# EAGLE design M220pal (EAGLE 6.6.0)
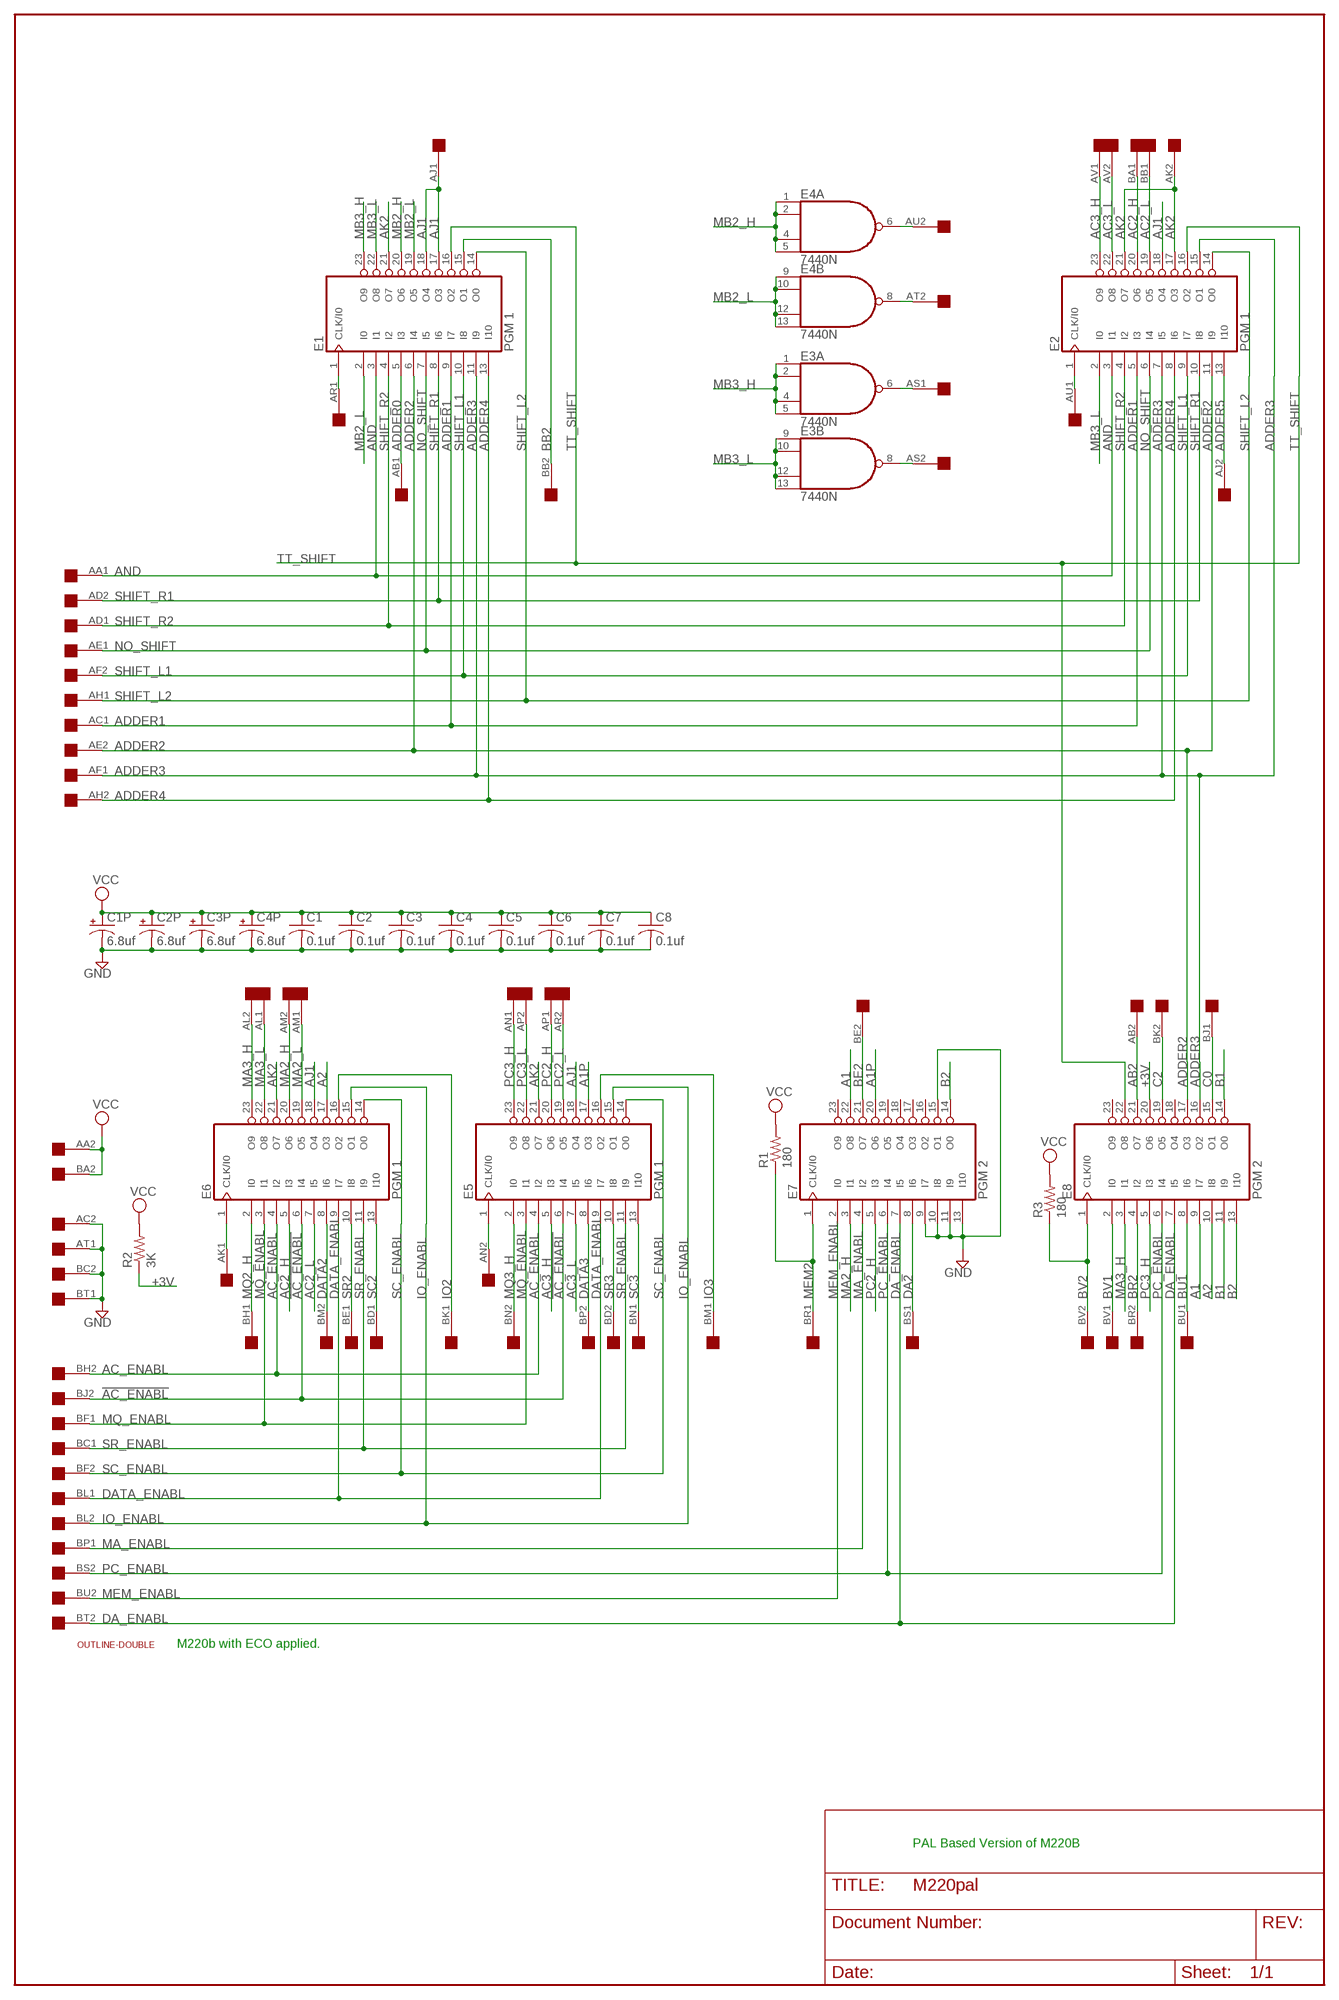
[diagram p0: schematic, sheet 1]

## Parts
C1  0.1uf  C-US050-025X075  [C050-025X075]
C1P  6.8uf  CPOL-USE15-5AXIAL  [E15-5]
C2  0.1uf  C-US050-025X075  [C050-025X075]
C2P  6.8uf  CPOL-USE15-5AXIAL  [E15-5]
C3  0.1uf  C-US050-025X075  [C050-025X075]
C3P  6.8uf  CPOL-USE15-5AXIAL  [E15-5]
C4  0.1uf  C-US050-025X075  [C050-025X075]
C4P  6.8uf  CPOL-USE15-5AXIAL  [E15-5]
C5  0.1uf  C-US050-025X075  [C050-025X075]
C6  0.1uf  C-US050-025X075  [C050-025X075]
C7  0.1uf  C-US050-025X075  [C050-025X075]
C8  0.1uf  C-US050-025X075  [C050-025X075]
E1  PGM 1  22V10  [DIL24-3]
E2  PGM 1  22V10  [DIL24-3]
E3  7440N  74S20N  [DIL14]
E4  7440N  74S20N  [DIL14]
E5  PGM 1  22V10  [DIL24-3]
E6  PGM 1  22V10  [DIL24-3]
E7  PGM 2  22V10  [DIL24-3]
E8  PGM 2  22V10  [DIL24-3]
R1  180  R-US_0207/10  [0207/10]
R2  3K  R-US_0207/10  [0207/10]
R3  180  R-US_0207/10  [0207/10]
U$1  DOUBLE  [EDGE-CON4]
U$2  OUTLINE-DOUBLE  [DOUBLE]

## Nets
!AC_ENABL: E5.6(I4) E6.6(I4) U$1.BJ2
+3V: E8.20(O6) R2.1
A1: E7.22(O8) E8.9(I7)
A1P: E5.17(O3) E7.20(O6)
A2: E6.17(O3) E8.10(I8)
AB2: E8.21(O7) U$1.AB2
AC2_H: E2.20(O6) E6.5(I3) U$1.BA1
AC2_L: E2.19(O5) E6.7(I5) U$1.BB1
AC3_H: E2.23(O9) E5.5(I3) U$1.AV1
AC3_L: E2.22(O8) E5.7(I5) U$1.AV2
AC_ENABL: E5.4(I2) E6.4(I2) U$1.BH2
ADDER0: E1.5(I3) U$1.AB1
ADDER1: E1.9(I7) E2.5(I3) U$1.AC1
ADDER2: E1.6(I4) E2.11(I9) E8.17(O3) U$1.AE2
ADDER3: E1.11(I9) E2.7(I5) E2.15(O1) E8.16(O2) U$1.AF1
ADDER4: E1.13(I10) E2.8(I6) U$1.AH2
ADDER5: E2.13(I10) U$1.AJ2
AJ1: E1.17(O3) E1.18(O4) E2.18(O4) E5.18(O4) E6.18(O4) U$1.AJ1
AK2: E1.21(O7) E2.17(O3) E2.21(O7) E5.21(O7) E6.21(O7) U$1.AK2
AND: E1.3(I1) E2.3(I1) U$1.AA1
AS1: E3.6(A:O) U$1.AS1
AS2: E3.8(B:O) U$1.AS2
AT2: E4.8(B:O) U$1.AT2
AU2: E4.6(A:O) U$1.AU2
B1: E8.11(I9) E8.14(O0)
B2: E7.14(O0) E8.13(I10)
BB2: E1.15(O1) U$1.BB2
BE2: E7.21(O7) U$1.BE2
BR2: E8.4(I2) U$1.BR2
BU1: E8.8(I6) U$1.BU1
BV1: E8.2(I0) U$1.BV1
BV2: E8.1(CLK/I0) R3.1 U$1.BV2
C0: E8.15(O1) U$1.BJ1
C2: E8.19(O5) U$1.BK2
DA2: E7.8(I6) U$1.BS1
DA_ENABL: E7.7(I5) E8.7(I5) U$1.BT2
DATA2: E6.8(I6) U$1.BM2
DATA3: E5.8(I6) U$1.BP2
DATA_ENABL: E5.9(I7) E6.9(I7) U$1.BL1
GND [Supply]: C1.2 C1P.- C2.2 C2P.- C3.2 C3P.- C4.2 C4P.- C5.2 C6.2 C7.2 C8.2 E7.9(I7) E7.10(I8) E7.11(I9) E7.13(I10) E7.15(O1) U$1.AC2 U$1.AT1 U$1.BC2 U$1.BT1
IO2: E6.16(O2) U$1.BK1
IO3: E5.16(O2) U$1.BM1
IO_ENABL: E5.15(O1) E6.15(O1) U$1.BL2
MA2_H: E6.20(O6) E7.3(I1) U$1.AM2
MA2_L: E6.19(O5) U$1.AM1
MA3_H: E6.23(O9) E8.3(I1) U$1.AL2
MA3_L: E6.22(O8) U$1.AL1
MA_ENABL: E7.4(I2) U$1.BP1
MB2_H: E1.20(O6) E4.1(A:I0) E4.2(A:I1) E4.4(A:I2) E4.5(A:I3)
MB2_L: E1.2(I0) E1.19(O5) E4.9(B:I0) E4.10(B:I1) E4.12(B:I2) E4.13(B:I3)
MB3_H: E1.23(O9) E3.1(A:I0) E3.2(A:I1) E3.4(A:I2) E3.5(A:I3)
MB3_L: E1.22(O8) E2.2(I0) E3.9(B:I0) E3.10(B:I1) E3.12(B:I2) E3.13(B:I3)
MEM2: E7.1(CLK/I0) R1.1 U$1.BR1
MEM_ENABL: E7.2(I0) U$1.BU2
MQ2_H: E6.2(I0) U$1.BH1
MQ3_H: E5.2(I0) U$1.BN2
MQ_ENABL: E5.3(I1) E6.3(I1) U$1.BF1
N$1: E6.1(CLK/I0) U$1.AK1
N$2: E5.1(CLK/I0) U$1.AN2
N$3: E1.1(CLK/I0) U$1.AR1
N$4: E2.1(CLK/I0) U$1.AU1
NO_SHIFT: E1.7(I5) E2.6(I4) U$1.AE1
PC2_H: E5.20(O6) E7.5(I3) U$1.AP1
PC2_L: E5.19(O5) U$1.AR2
PC3_H: E5.23(O9) E8.5(I3) U$1.AN1
PC3_L: E5.22(O8) U$1.AP2
PC_ENABL: E7.6(I4) E8.6(I4) U$1.BS2
SC2: E6.13(I10) U$1.BD1
SC3: E5.13(I10) U$1.BN1
SC_ENABL: E5.14(O0) E6.14(O0) U$1.BF2
SHIFT_L1: E1.10(I8) E2.9(I7) U$1.AF2
SHIFT_L2: E1.14(O0) E2.14(O0) U$1.AH1
SHIFT_R1: E1.8(I6) E2.10(I8) U$1.AD2
SHIFT_R2: E1.4(I2) E2.4(I2) U$1.AD1
SR2: E6.10(I8) U$1.BE1
SR3: E5.10(I8) U$1.BD2
SR_ENABL: E5.11(I9) E6.11(I9) U$1.BC1
TT_SHIFT: E1.16(O2) E2.16(O2) E8.22(O8)
VCC [Supply]: C1.1 C1P.+ C2.1 C2P.+ C3.1 C3P.+ C4.1 C4P.+ C5.1 C6.1 C7.1 C8.1 R1.2 R2.2 R3.2 U$1.AA2 U$1.BA2
Unconnected: E7.16(O2) E7.17(O3) E7.18(O4) E7.19(O5) E7.23(O9) E8.18(O4) E8.23(O9)

## Notes on the sheet
- M220b with ECO applied.
- PAL Based Version of M220B

## Power pins joined to a net without a drawn wire
GND: E1.12(GND) E2.12(GND) E3.7(P:GND) E4.7(P:GND) E5.12(GND) E6.12(GND) E7.12(GND) E8.12(GND)
VCC: E1.24(VCC) E2.24(VCC) E3.14(P:VCC) E4.14(P:VCC) E5.24(VCC) E6.24(VCC) E7.24(VCC) E8.24(VCC)

## Library data of the parts
C1-C8 = rcl:C-US: CAPACITOR, American symbol
C1P C2P C3P C4P = rcl:CPOL-US: POLARIZED CAPACITOR, American symbol
E1 E2 E5-E8 = pal:22V10: PAL; MPN: GAL22V10D-7LPN; OC_FARNELL: 1571925; OC_NEWARK: 97M0480
E3 E4 = 74xx-us:74*20: Dual 4-input NAND gate
R1-R3 = rcl:R-US_: RESISTOR, American symbol
U$1 = dec-con:DOUBLE: Double-Height DEC board
U$2 = dec-con:OUTLINE-*: Board outlines for DEC boards.

## Net classes
1 Supply: width 0.813 mm

## Board
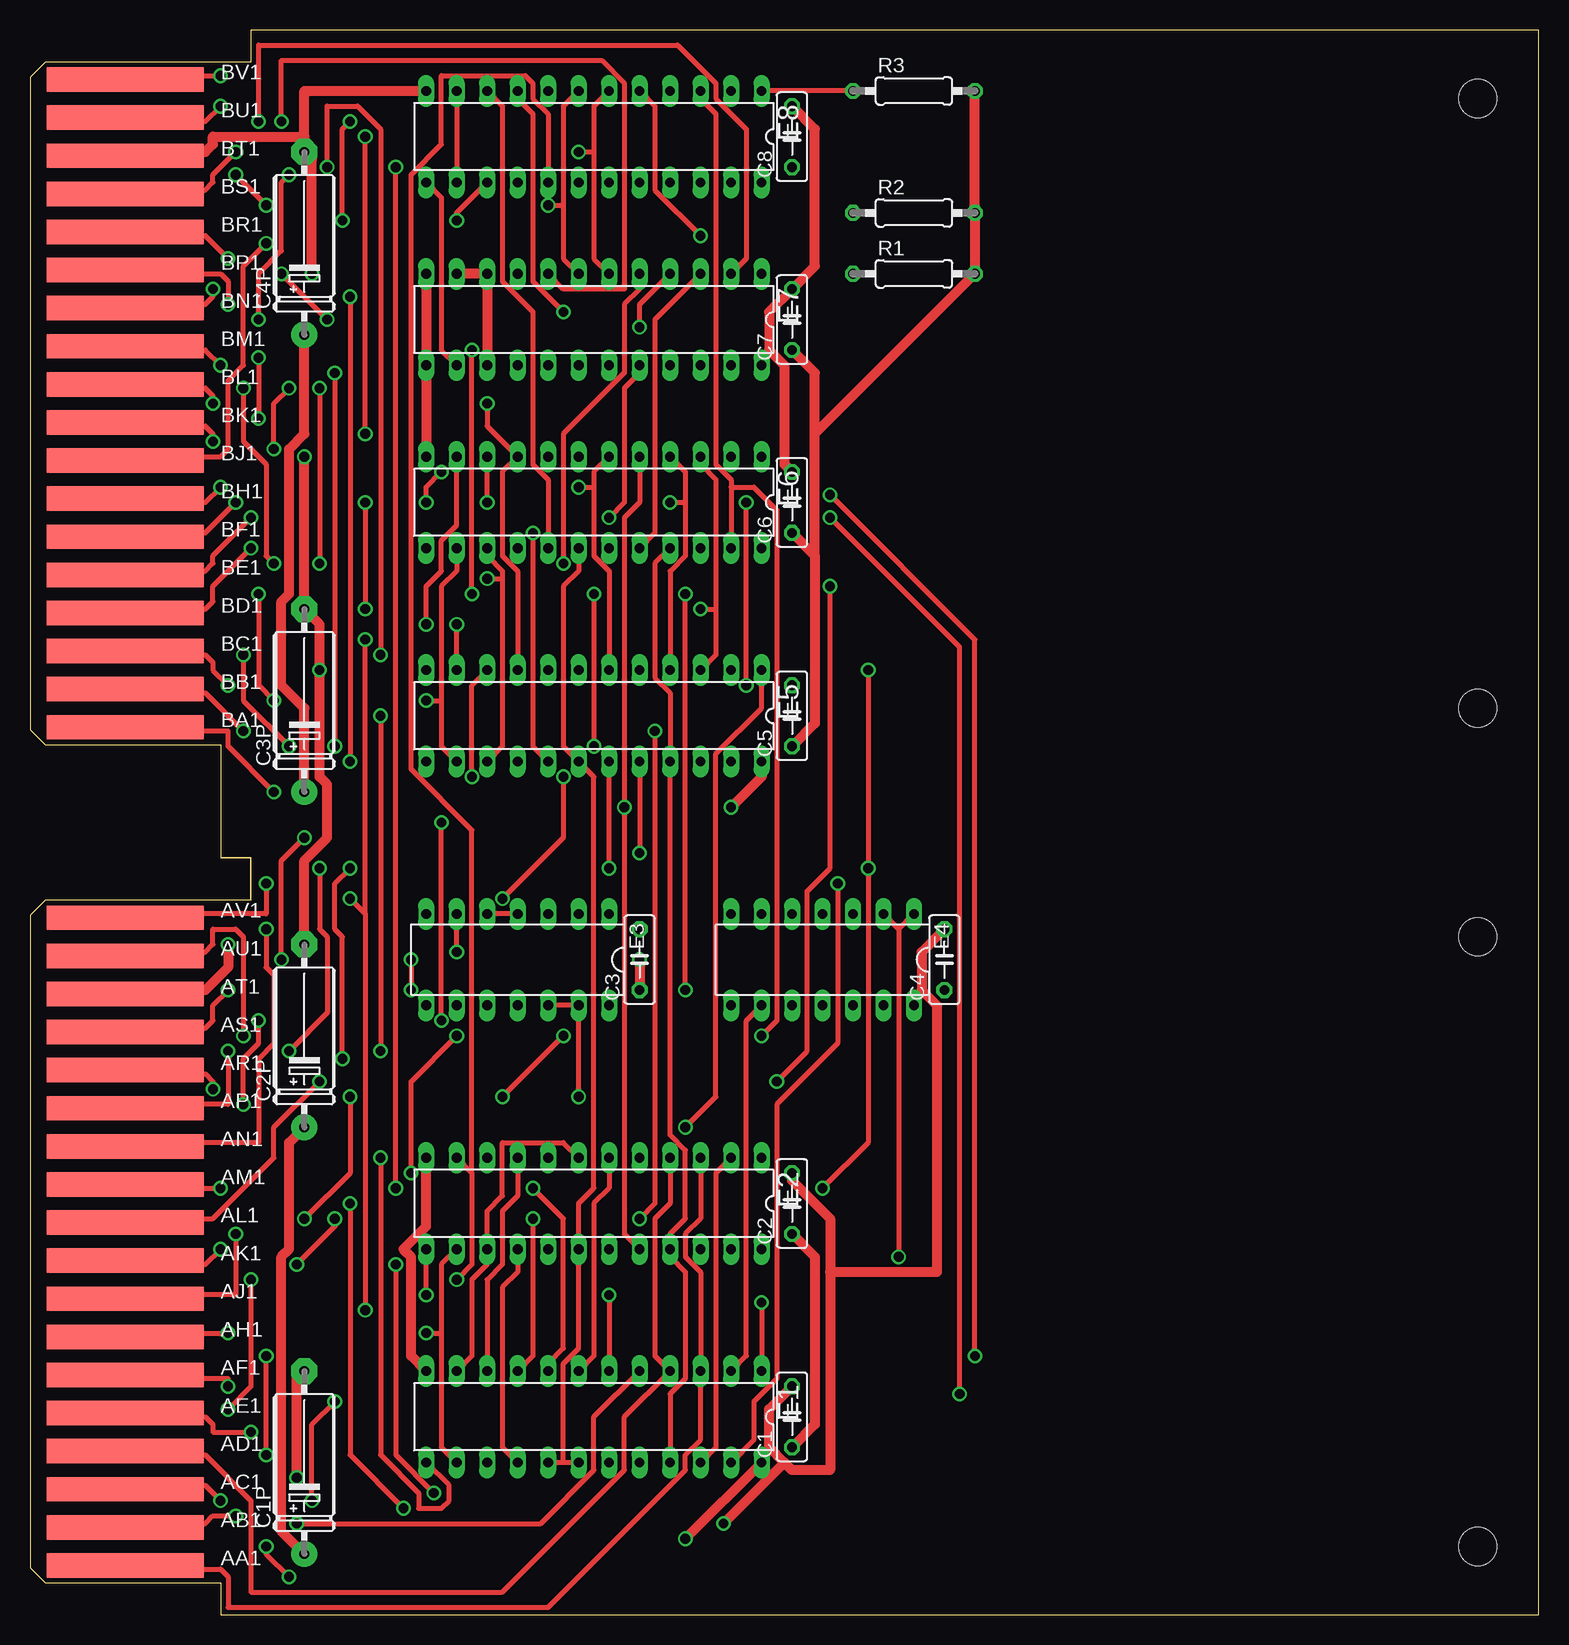
[diagram p1: board, top side]
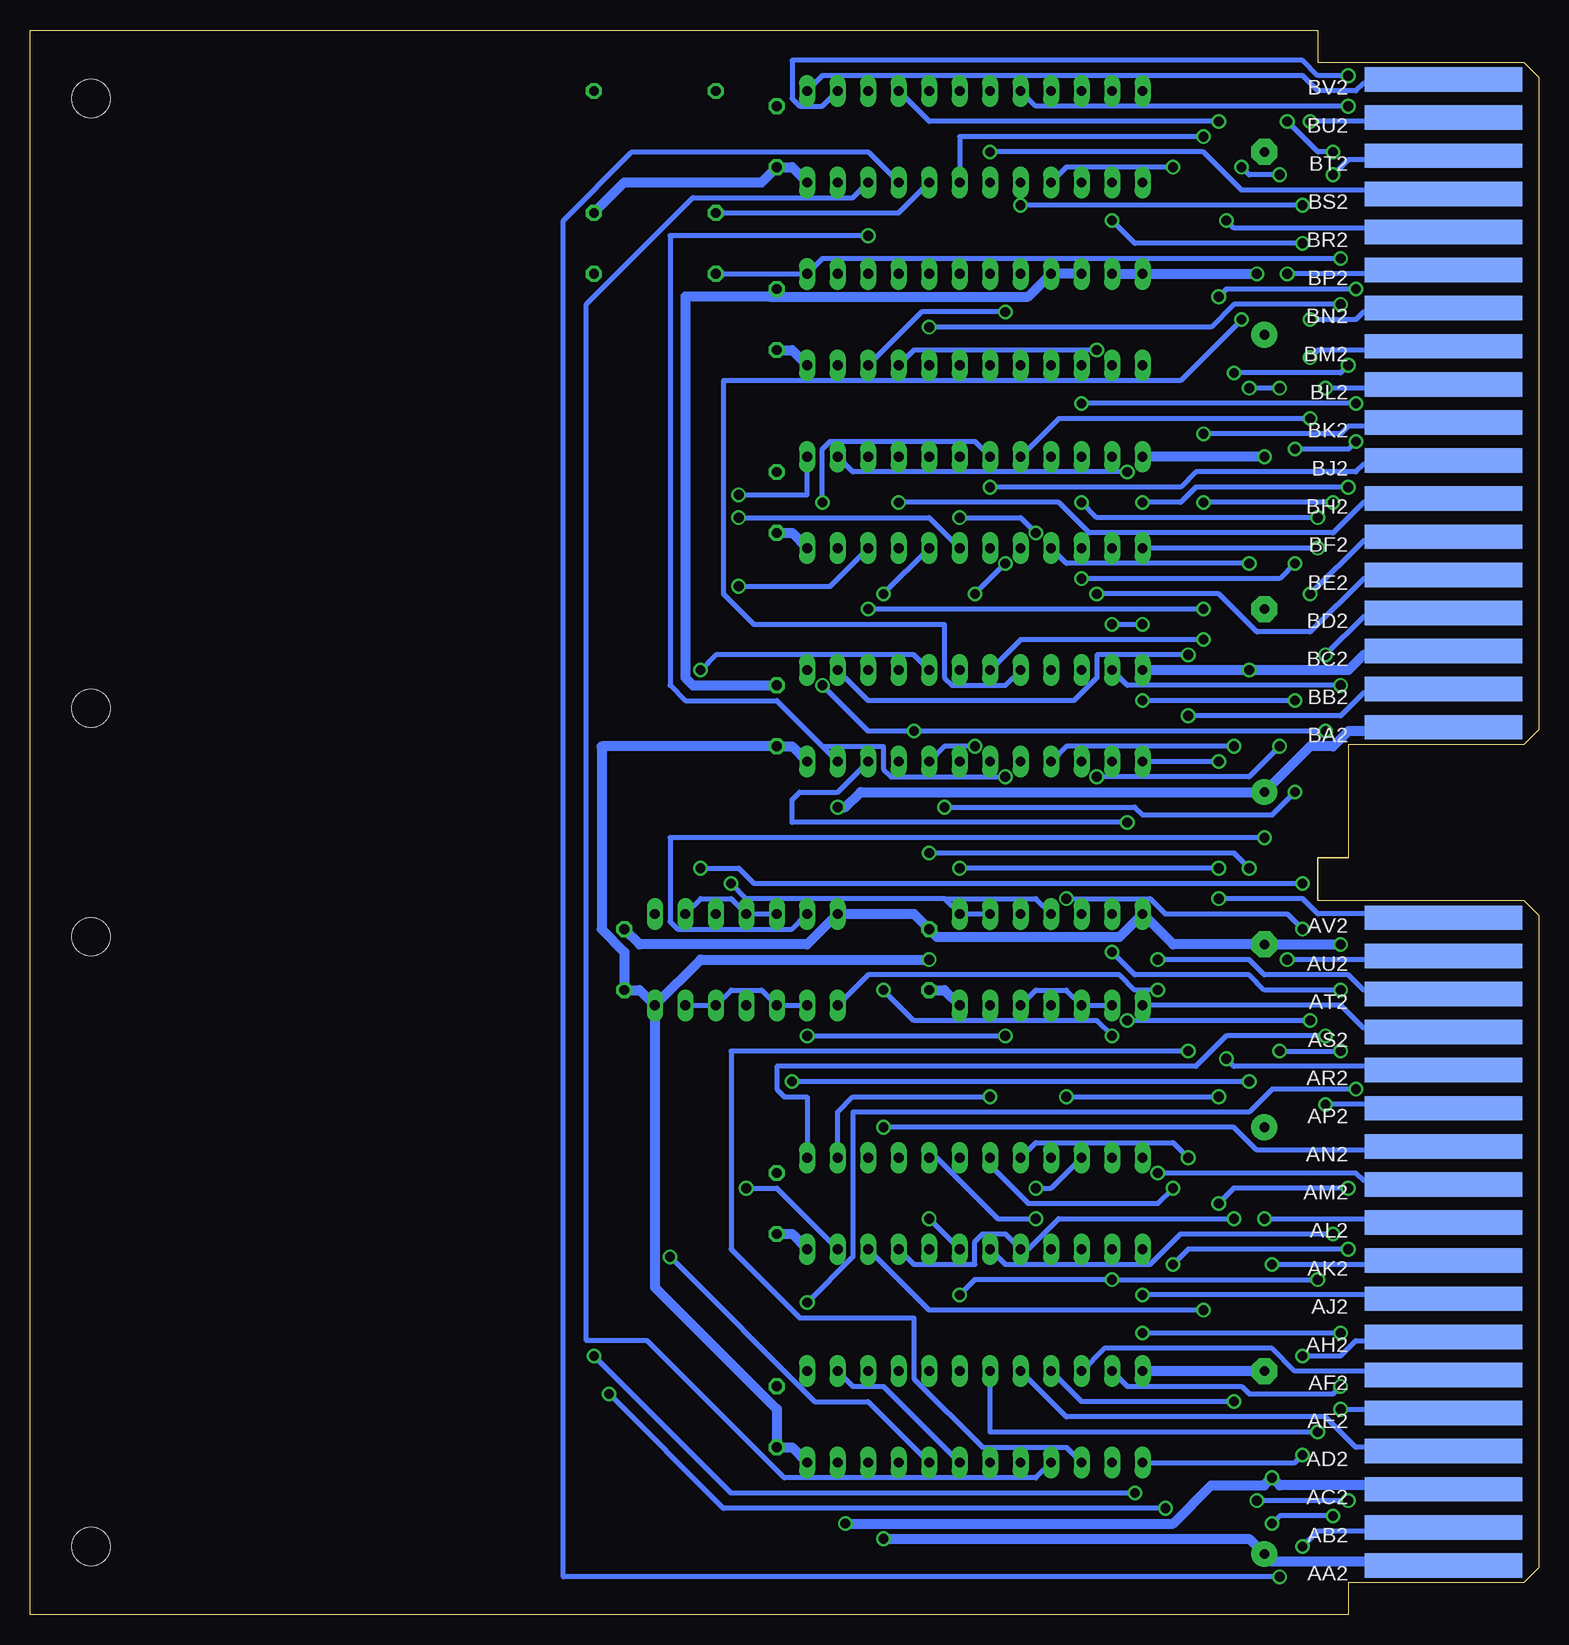
[diagram p2: board, bottom side, seen from below]

Size 125.73 x 132.08 mm. Coordinates in mm from the lower left corner, seen from the top.
Copper layers (1+16): Top 0.035mm / dielectric 1.5mm / Bottom 0.035mm
Design rules "16mils": minimum track width 16mil, minimum drill 32mil, track to track 15mil, track to pad 10mil, pad to pad 10mil, via to via 10mil, smd to smd 10mil, copper to edge 13mil, drill to drill 10mil, minimum pad ring 10mil, minimum via ring 8mil, stop-mask expansion 0mil, vias tented up to drill 0mil, thermal gap 10mil

### Footprints (pad centres in the part's own frame; a part is rotated, then mirrored left to right if it is on the bottom)
C050-025X075 = drill 0.813 octagon: 1 -2.54,0; 2 2.54,0
E15-5 = drill 0.813 pad 2.159: + -7.62,0 | drill 0.813 pad 2.159 octagon: - 7.62,0
DIL24-3 = drill 0.813 long: 1 -13.97,-3.81; 2 -11.43,-3.81; 3 -8.89,-3.81; 4 -6.35,-3.81; 5 -3.81,-3.81; 6 -1.27,-3.81; 7 1.27,-3.81; 8 3.81,-3.81; 9 6.35,-3.81; 10 8.89,-3.81; 11 11.43,-3.81; 12 13.97,-3.81; 13 13.97,3.81; 14 11.43,3.81; 15 8.89,3.81; 16 6.35,3.81; 17 3.81,3.81; 18 1.27,3.81; 19 -1.27,3.81; 20 -3.81,3.81; 21 -6.35,3.81; 22 -8.89,3.81; 23 -11.43,3.81; 24 -13.97,3.81
DIL14 = drill 0.813 long: 1 -7.62,-3.81; 2 -5.08,-3.81; 3 -2.54,-3.81; 4 0,-3.81; 5 2.54,-3.81; 6 5.08,-3.81; 7 7.62,-3.81; 8 7.62,3.81; 9 5.08,3.81; 10 2.54,3.81; 11 0,3.81; 12 -2.54,3.81; 13 -5.08,3.81; 14 -7.62,3.81
0207/10 = drill 0.813 octagon: 1 -5.08,0; 2 5.08,0
EDGE-CON4 = smd 13.106 x 2.032: AA1 7.938,4.128; AB1 7.938,7.303; AC1 7.938,10.477; AD1 7.938,13.652; AE1 7.938,16.828; AF1 7.938,20.003; AH1 7.938,23.177; AJ1 7.938,26.352; AK1 7.938,29.527; AL1 7.938,32.703; AM1 7.938,35.877; AN1 7.938,39.053; AP1 7.938,42.227; AR1 7.938,45.403; AS1 7.938,48.578; AT1 7.938,51.752; AU1 7.938,54.928; AV1 7.938,58.102; BA1 7.938,73.978; BB1 7.938,77.153; BC1 7.938,80.328; BD1 7.938,83.502; BE1 7.938,86.677; BF1 7.938,89.853; BH1 7.938,93.028; BJ1 7.938,96.203; BK1 7.938,99.377; BL1 7.938,102.552; BM1 7.938,105.728; BN1 7.938,108.903; BP1 7.938,112.078; BR1 7.938,115.252; BS1 7.938,118.427; BT1 7.938,121.603; BU1 7.938,124.778; BV1 7.938,127.953 | smd 13.106 x 2.032 bottom: AA2 7.938,4.128; AB2 7.938,7.303; AC2 7.938,10.477; AD2 7.938,13.652; AE2 7.938,16.828; AF2 7.938,20.003; AH2 7.938,23.177; AJ2 7.938,26.352; AK2 7.938,29.527; AL2 7.938,32.703; AM2 7.938,35.877; AN2 7.938,39.053; AP2 7.938,42.227; AR2 7.938,45.403; AS2 7.938,48.578; AT2 7.938,51.752; AU2 7.938,54.928; AV2 7.938,58.102; BA2 7.938,73.978; BB2 7.938,77.153; BC2 7.938,80.328; BD2 7.938,83.502; BE2 7.938,86.677; BF2 7.938,89.853; BH2 7.938,93.028; BJ2 7.938,96.203; BK2 7.938,99.377; BL2 7.938,102.552; BM2 7.938,105.728; BN2 7.938,108.903; BP2 7.938,112.078; BR2 7.938,115.252; BS2 7.938,118.427; BT2 7.938,121.603; BU2 7.938,124.778; BV2 7.938,127.953
DOUBLE = hole 3.175: 120.65,56.515; 120.65,5.715; 120.65,75.565; 120.65,126.365

### Placement (x,y rotation side)
C1  63.5,16.51 90 top
C1P  22.86,12.7 90 top
C2  63.5,34.29 90 top
C2P  22.86,48.26 90 top
C3  50.8,54.61 90 top
C3P  22.86,76.2 90 top
C4  76.2,54.61 90 top
C4P  22.86,114.3 90 top
C5  63.5,74.93 90 top
C6  63.5,92.71 90 top
C7  63.5,107.95 90 top
C8  63.5,123.19 90 top
E1  46.99,16.51 180 top
E2  46.99,34.29 180 top
E3  40.64,54.61 180 top
E4  66.04,54.61 180 top
E5  46.99,74.93 180 top
E6  46.99,92.71 180 top
E7  46.99,107.95 180 top
E8  46.99,123.19 180 top
R1  73.66,111.76 0 top
R2  73.66,116.84 0 top
R3  73.66,127 0 top
U$1  0,0 0 top
U$2  0,0 0 top

### Tracks (layer width: path | path; a pad name or v marks a point on that pad's centre or on a via)
!AC_ENABL  (via drill 0.81)
  Top 0.406: E5.6 48.26,87 46.99,88.27 46.99,93.98 | 46.99,93.98 46.99,95.25 E6.6 | v45.72,93.98 46.99,93.98
  Bottom 0.406: v45.72,93.98 29.85,93.98 28.58,95.25 15.24,95.25 14.61,95.89 8.26,95.89 U$1.BJ2
+3V
  Bottom 0.406: E8.20 53.34,116.84 R2.1
A1  (via drill 0.81)
  Top 0.406: v44.45,108.58 41.91,111.12 41.91,125.09 40.64,126.36 E8.9
  Bottom 0.406: E7.22 51.44,108.58 v44.45,108.58
A1P  (via drill 0.81)
  Top 0.406: E5.17 41.91,72.39 v41.91,90.17 | v48.26,91.44 49.53,92.71 49.53,102.23 50.8,103.5 E7.20
  Bottom 0.406: v41.91,90.17 43.18,91.44 v48.26,91.44
A2
  Top 0.406: E6.17 43.18,94.61 41.91,95.89 41.91,108.58 39.37,111.12 39.37,125.73 E8.10
AB2  (via drill 0.81)
  Top 0.406: v21.59,3.17 19.69,5.08 v19.69,5.71
  Bottom 0.406: E8.21 55.88,121.92 75.57,121.92 81.28,116.2 81.28,3.17 v21.59,3.17 | v19.69,5.71 18.42,6.99 8.26,6.99 U$1.AB2
AC2_H  (via drill 0.81)
  Top 0.406: E2.20 49.53,31.75 v49.53,67.31 49.53,91.44 50.8,92.71 E6.5 | v20.32,68.58 16.51,72.39 16.51,73.66 8.26,73.66 U$1.BA1
  Bottom 0.406: v20.32,68.58 22.23,66.67 33.02,66.67 33.66,67.31 v49.53,67.31
AC2_L  (via drill 0.81)
  Top 0.406: v59.69,77.47 v59.69,92.71 | v17.78,73.66 14.61,76.83 8.26,76.83 U$1.BB1 | v50.8,33.02 52.07,34.29 v52.07,73.66
  Bottom 0.406: E6.7 46.99,97.79 59.06,97.79 59.69,97.16 v59.69,92.71 | v59.69,77.47 55.88,73.66 v52.07,73.66 v17.78,73.66 | v50.8,33.02 E2.19
AC3_H  (via drill 0.81)
  Top 0.406: v66.04,35.56 69.85,39.37 v69.85,62.23 v69.85,78.74 | v19.69,60.96 19.69,58.42 8.26,58.42 U$1.AV1
  Bottom 0.406: E2.23 63.5,35.56 v66.04,35.56 | v69.85,78.74 68.58,80.01 52.07,80.01 E5.5 | v19.69,60.96 65.41,60.96 66.68,62.23 v69.85,62.23
AC3_L  (via drill 0.81)
  Top 0.406: 27.94,58.42 v27.94,25.4 | v26.67,59.69 27.94,58.42 | 27.94,58.42 v27.94,81.28
  Bottom 0.406: E2.22 50.8,25.4 v27.94,25.4 | v26.67,59.69 19.69,59.69 18.42,58.42 8.26,58.42 U$1.AV2 | E5.7 43.18,81.28 v27.94,81.28
AC_ENABL  (via drill 0.81)
  Top 0.406: E5.4 53.34,87 54.61,88.27 54.61,92.71 | 54.61,92.71 54.61,95.25 E6.4 | v53.34,92.71 54.61,92.71
  Bottom 0.406: v53.34,92.71 40.01,92.71 37.47,90.17 17.15,90.17 14.61,92.71 8.26,92.71 U$1.BH2
ADDER0  (via drill 0.81)
  Top 0.406: E1.5 46.99,16.51 46.99,12.06 42.55,7.62 v22.23,7.62 | v17.15,8.26 15.24,8.26 14.61,7.62 8.26,7.62 U$1.AB1
  Bottom 0.406: v22.23,7.62 21.59,8.26 v17.15,8.26
ADDER1  (via drill 0.81)
  Top 0.406: E1.9 41.91,21.59 v41.91,33.02 | v25.4,17.78 23.5,15.88 v23.5,9.53 | v15.88,9.53 14.61,10.79 8.26,10.79 U$1.AC1
  Bottom 0.406: v41.91,33.02 45.09,33.02 50.17,38.1 E2.5 | E1.9 38.1,17.78 v25.4,17.78 | v15.88,9.53 v23.5,9.53
ADDER2  (via drill 0.81)
  Top 0.406: v48.26,26.67 E1.6 | v35.56,27.94 36.83,29.21 36.83,36.83 | E2.11 36.83,36.83 | E8.17 43.18,125.09 41.91,126.36 41.91,127.64 41.28,128.27 34.29,128.27 34.29,122.56 31.75,120.02 31.75,70.48 36.83,65.41 36.83,36.83 | v16.51,17.14 18.42,19.05 v18.42,27.94
  Bottom 0.406: v48.26,26.67 46.99,27.94 v35.56,27.94 v18.42,27.94 | v16.51,17.14 8.26,17.14 U$1.AE2
ADDER3  (via drill 0.81)
  Top 0.406: E1.11 36.83,21.59 36.83,27.94 38.1,29.21 E2.15 38.1,33.66 39.37,34.92 39.37,39.37 44.45,39.37 E2.7 | v30.48,35.56 v30.48,120.65 | v16.51,19.05 16.51,19.68 8.26,19.68 U$1.AF1
  Bottom 0.406: E8.16 39.37,120.65 v30.48,120.65 | v30.48,35.56 31.75,34.29 42.55,34.29 45.72,37.47 E2.7 | v16.51,19.05 17.15,18.41 24.13,18.41 24.77,19.05 34.29,19.05 E1.11
ADDER4  (via drill 0.81)
  Top 0.406: E1.13 34.93,10.79 34.93,9.53 34.29,8.89 32.39,8.89 32.39,10.16 29.21,13.34 v29.21,38.1 | v19.69,13.34 v19.69,21.59
  Bottom 0.406: v29.21,38.1 30.48,39.37 41.91,39.37 E2.8 | v19.69,21.59 16.51,21.59 15.24,22.86 8.26,22.86 U$1.AH2 | v19.69,13.34 20.32,12.7 E1.13
ADDER5  (via drill 0.81)
  Top 0.406: v33.02,26.67 E2.13
  Bottom 0.406: v33.02,26.67 8.26,26.67 U$1.AJ2
AJ1  (via drill 0.81)
  Top 0.406: E6.18 45.72,87 44.45,85.72 44.45,72.39 E5.18 46.99,69.85 46.99,35.56 45.72,34.29 E2.18 45.72,22.23 44.45,20.95 44.45,12.7 | E1.18 44.45,12.7 | 44.45,12.7 E1.17 | v17.15,31.75 17.15,26.67 8.26,26.67 U$1.AJ1
  Bottom 0.406: v17.15,31.75 29.85,31.75 32.39,29.21 44.45,29.21 E2.18
AK2  (via drill 0.81)
  Top 0.406: E6.21 52.07,87.63 52.07,78.11 53.34,76.83 E5.21 53.34,40.01 54.61,38.73 54.61,33.02 53.34,31.75 E2.21 53.34,29.84 54.61,28.57 54.61,19.68 53.34,18.41 E1.21 | v22.23,29.21 25.4,32.38 v25.4,33.02
  Bottom 0.406: E2.21 52.07,29.21 46.99,29.21 46.99,31.11 46.36,31.75 44.45,31.75 E2.17 42.55,30.48 40.01,33.02 v25.4,33.02 | v22.23,29.21 8.26,29.21 U$1.AK2
AND
  Top 0.406: E2.3 55.88,33.02 54.61,31.75 54.61,29.84 55.88,28.57 E1.3 55.88,14.61 54.61,13.34 54.61,12.06 43.18,0.64 16.51,0.64 16.51,3.17 15.88,3.81 8.26,3.81 U$1.AA1
AS1  (via drill 0.81)
  Top 0.406: v35.56,55.24 E3.6 | v16.51,52.07 15.24,50.8 15.24,49.53 14.61,48.9 8.26,48.9 U$1.AS1
  Bottom 0.406: v35.56,55.24 33.66,53.34 24.13,53.34 22.86,52.07 v16.51,52.07
AS2
  Bottom 0.406: E3.8 16.51,50.8 14.61,48.9 8.26,48.9 U$1.AS2
AT2  (via drill 0.81)
  Top 0.406: v31.75,54.61 v31.75,52.07
  Bottom 0.406: E4.8 55.88,53.34 34.93,53.34 33.66,52.07 v31.75,52.07 | v31.75,54.61 24.13,54.61 22.86,53.34 15.88,53.34 14.61,52.07 8.26,52.07 U$1.AT2
AU2  (via drill 0.81)
  Top 0.406: v22.86,64.77 20.96,62.87 v20.96,54.61
  Bottom 0.406: E4.6 62.23,57.15 71.76,57.15 72.39,57.78 72.39,64.77 v22.86,64.77 | v20.96,54.61 8.26,54.61 U$1.AU2
B1
  Top 0.406: E8.11 E8.14
B2
  Top 0.406: E7.14 34.29,105.41 34.29,118.11 E8.13
BB2  (via drill 0.81)
  Top 0.406: v29.21,74.93 v29.21,46.99
  Bottom 0.406: E1.15 39.37,13.97 46.36,13.97 52.07,19.68 52.07,24.77 61.6,24.77 67.31,30.48 67.31,46.99 v29.21,46.99 | v29.21,74.93 16.51,74.93 14.61,76.83 8.26,76.83 U$1.BB2
BE2  (via drill 0.81)
  Top 0.406: v36.83,85.09 v36.83,105.41
  Bottom 0.406: E7.21 52.07,105.41 v36.83,105.41 | v36.83,85.09 26.67,85.09 23.5,81.92 19.05,81.92 14.61,86.36 8.26,86.36 U$1.BE2
BR2  (via drill 0.81)
  Top 0.406: v26.67,124.46 26.04,123.83 v26.04,116.2
  Bottom 0.406: E8.4 50.8,124.46 v26.67,124.46 | v26.04,116.2 25.4,115.57 8.26,115.57 U$1.BR2
BU1  (via drill 0.81)
  Top 0.406: v15.88,125.73 14.61,124.46 8.26,124.46 U$1.BU1
  Bottom 0.406: E8.8 41.91,125.73 v15.88,125.73
BV1  (via drill 0.81)
  Top 0.406: v15.88,128.27 8.26,128.27 U$1.BV1
  Bottom 0.406: E8.2 59.69,125.73 61.6,125.73 62.23,126.36 62.23,129.54 19.69,129.54 18.42,128.27 v15.88,128.27
BV2
  Top 0.406: R3.1 E8.1
  Bottom 0.406: E8.1 59.69,128.27 19.69,128.27 18.42,127 15.24,127 14.61,127.64 8.26,127.64 U$1.BV2
C0  (via drill 0.81)
  Top 0.406: E8.15 35.56,116.84 v35.56,116.2 | v19.69,114.3 17.78,112.39 17.78,104.14 16.51,102.87 16.51,97.16 15.88,96.52 8.26,96.52 U$1.BJ1
  Bottom 0.406: v35.56,116.2 33.66,114.3 v19.69,114.3
C2  (via drill 0.81)
  Top 0.406: v27.94,98.42 v27.94,123.19
  Bottom 0.406: E8.19 48.26,123.19 v27.94,123.19 | v27.94,98.42 16.51,98.42 15.88,99.06 8.26,99.06 U$1.BK2
DA2  (via drill 0.81)
  Top 0.406: E7.8 44.45,110.49 49.53,110.49 49.53,127.64 47.63,129.54 20.96,129.54 v20.96,124.46 | v17.15,121.92 15.24,120.02 15.24,119.38 14.61,118.75 8.26,118.75 U$1.BS1
  Bottom 0.406: v20.96,124.46 18.42,121.92 v17.15,121.92
DA_ENABL  (via drill 0.81)
  Top 0.406: E7.7 44.45,113.03 44.45,117.47 | 44.45,117.47 44.45,125.73 E8.7 | v43.18,117.47 44.45,117.47 | v17.15,120.02 v19.69,117.47
  Bottom 0.406: v19.69,117.47 v43.18,117.47 | v17.15,120.02 15.88,121.28 8.26,121.28 U$1.BT2
DATA2  (via drill 0.81)
  Top 0.406: v19.05,104.78 v19.05,99.69
  Bottom 0.406: E6.8 40.01,99.69 v19.05,99.69 | v19.05,104.78 18.42,105.41 8.26,105.41 U$1.BM2
DATA3  (via drill 0.81)
  Top 0.406: v20.96,111.76 v24.77,107.95
  Bottom 0.406: E5.8 44.45,77.47 48.9,77.47 49.53,78.11 49.53,82.55 65.41,82.55 67.95,85.09 67.95,102.87 29.85,102.87 v24.77,107.95 | v20.96,111.76 8.26,111.76 U$1.BP2
DATA_ENABL  (via drill 0.81)
  Top 0.406: E5.9 40.64,87 39.37,88.27 39.37,95.25 E6.9 38.1,99.06 v38.1,100.97 | v15.24,100.97 15.24,101.6 14.61,102.23 8.26,102.23 U$1.BL1
  Bottom 0.406: v15.24,100.97 v38.1,100.97
GND  (via drill 0.81)
  Top 0.813: E8.12 22.86,127 22.86,123.19 | 22.86,123.19 C4P.- 23.5,121.28 v23.5,111.76 | 22.86,123.19 15.24,123.19 15.24,122.56 14.61,121.92 8.26,121.92 U$1.BT1 | E6.12 E7.13 E7.12 | E7.15 E7.10 E7.11 | C6.2 62.87,95.89 62.87,104.14 61.6,105.41 61.6,108.58 C7.2 65.41,112.39 65.41,123.83 C8.2 | C2P.- 22.86,62.87 24.77,64.77 24.77,69.22 24.13,69.85 v24.13,78.74 24.13,82.55 C3P.- v22.86,96.52 | v16.51,55.88 16.51,53.98 14.61,52.07 8.26,52.07 U$1.AT1 | E2.12 33.02,32.38 31.12,30.48 31.75,29.84 31.75,21.59 E1.12 | C1P.- 22.23,19.68 v22.23,11.43 | C1.2 61.6,17.14 61.6,13.97 62.87,12.7 | 62.87,12.7 63.5,12.06 66.68,12.06 66.68,28.57 | 66.68,28.57 66.68,33.02 63.5,36.2 C2.2 | 66.68,28.57 75.57,28.57 75.57,50.8 74.3,52.07 74.3,55.24 C4.2 | 62.87,12.7 v57.79,7.62
  Bottom 0.813: E7.11 E7.12 v23.5,111.76 | E7.10 E7.9 42.55,109.86 64.14,109.86 | C5.2 70.49,77.47 71.12,78.11 71.12,109.86 64.14,109.86 | C7.2 64.14,109.86 | E5.12 v24.13,78.74 15.88,78.74 14.61,80.01 8.26,80.01 U$1.BC2 | v16.51,55.88 C2P.- 30.48,55.88 E3.7 34.93,56.52 50.17,56.52 C3.2 52.07,58.42 E4.7 60.96,55.88 74.93,55.88 C4.2 | C1P.- E1.12 | U$1.AC2 8.26,10.79 21.59,10.79 v22.23,11.43 22.86,10.79 27.31,10.79 30.48,7.62 v57.79,7.62 | v22.86,96.52 E6.12
IO2  (via drill 0.81)
  Top 0.406: v24.13,102.23 v24.13,87.63 | v21.59,102.23 20.32,100.97 v20.32,97.16 | v15.24,97.79 15.24,98.42 14.61,99.06 8.26,99.06 U$1.BK1
  Bottom 0.406: E6.16 39.37,87.63 v24.13,87.63 | v21.59,102.23 v24.13,102.23 | v20.32,97.16 15.88,97.16 v15.24,97.79
IO3  (via drill 0.81)
  Top 0.406: v25.4,103.5 v25.4,72.39 | v15.88,104.14 14.61,105.41 8.26,105.41 U$1.BM1
  Bottom 0.406: E5.16 39.37,72.39 v25.4,72.39 | v25.4,103.5 16.51,103.5 v15.88,104.14
IO_ENABL  (via drill 0.81)
  Top 0.406: E5.15 39.37,72.39 39.37,86.36 | 39.37,86.36 39.37,87 38.1,88.27 E6.15 | v38.1,86.36 39.37,86.36 | v20.32,87.63 19.69,88.27 19.69,95.89 17.78,97.79 v17.78,102.23
  Bottom 0.406: v38.1,86.36 21.59,86.36 v20.32,87.63 | v17.78,102.23 8.26,102.23 U$1.BL2
MA2_H  (via drill 0.81)
  Top 0.406: E6.20 52.07,90.17 52.07,107.95 E7.3 | v54.61,52.07 v54.61,85.09 | v35.56,48.26 31.75,44.45 v31.75,36.83
  Bottom 0.406: v54.61,85.09 E6.20 | v54.61,52.07 52.07,49.53 36.83,49.53 v35.56,48.26 | v31.75,36.83 15.24,36.83 14.61,36.2 8.26,36.2 U$1.AM2
MA2_L  (via drill 0.81)
  Top 0.406: v66.68,91.44 77.47,80.64 v77.47,18.41 | v31.12,8.89 26.67,13.34 v26.67,34.29 | v15.88,35.56 8.26,35.56 U$1.AM1
  Bottom 0.406: E6.19 50.8,91.44 v66.68,91.44 | v77.47,18.41 67.95,8.89 v31.12,8.89 | v26.67,34.29 25.4,35.56 v15.88,35.56
MA3_H  (via drill 0.81)
  Top 0.406: 58.42,93.98 58.42,94.61 57.15,95.89 57.15,125.09 55.88,126.36 E8.3 | 58.42,93.98 E6.23 | v22.86,33.02 26.67,36.83 v26.67,43.18 | v44.45,48.26 v39.37,43.18 | v60.96,48.26 62.23,49.53 62.23,92.08 60.33,93.98 58.42,93.98
  Bottom 0.406: v22.86,33.02 8.26,33.02 U$1.AL2 | v39.37,43.18 v26.67,43.18 | v60.96,48.26 v44.45,48.26
MA3_L  (via drill 0.81)
  Top 0.406: v66.68,85.72 66.68,62.23 64.77,60.33 64.77,46.99 v62.23,44.45 | v24.13,44.45 20.32,40.64 20.32,38.1 15.24,33.02 8.26,33.02 U$1.AL1
  Bottom 0.406: E6.22 59.06,85.72 v66.68,85.72 | v24.13,44.45 v62.23,44.45
MA_ENABL  (via drill 0.81)
  Top 0.406: E7.4 50.8,109.22 v50.8,107.31 | v16.51,109.22 16.51,111.12 15.88,111.76 8.26,111.76 U$1.BP1
  Bottom 0.406: v50.8,107.31 27.31,107.31 25.4,109.22 v16.51,109.22
MB2_H  (via drill 0.81)
  Top 0.406: 72.39,57.15 v72.39,29.84 | E4.2 72.39,57.15 | 72.39,57.15 E4.1
  Bottom 0.406: E4.5 E4.4 67.31,59.69 69.85,59.69 E4.2 | E1.20 55.88,17.78 60.33,17.78 v72.39,29.84
MB2_L
  Top 0.406: E4.9 59.69,49.53 59.69,21.59 E1.2
  Bottom 0.406: E4.9 E4.10 64.77,52.07 67.31,52.07 E4.12 E4.13 | E1.19 54.61,19.05 57.15,19.05 E1.2
MB3_H  (via drill 0.81)
  Top 0.406: E3.4 E3.5 | E1.23 60.33,14.61 60.33,17.78 62.23,19.68 62.23,42.55 67.31,47.62 v67.31,60.96
  Bottom 0.406: E3.2 E3.1 49.53,59.69 | v67.31,60.96 66.04,59.69 49.53,59.69 | E3.4 41.91,59.69 49.53,59.69
MB3_L  (via drill 0.81)
  Top 0.406: E3.12 E3.13 v45.72,43.18 | E1.22 57.15,13.97 57.15,36.83 E2.2
  Bottom 0.406: E3.9 E3.10 39.37,52.07 41.91,52.07 E3.12 | v45.72,43.18 57.15,43.18 58.42,41.91 E2.2
MEM2  (via drill 0.81)
  Top 0.406: v16.51,113.03 14.61,114.94 8.26,114.94 U$1.BR1
  Bottom 0.406: R1.1 E7.1 59.69,113.03 v16.51,113.03
MEM_ENABL  (via drill 0.81)
  Top 0.406: E7.2 59.69,113.03 59.69,123.83 57.15,126.36 57.15,127.64 53.98,130.81 19.05,130.81 v19.05,124.46
  Bottom 0.406: v19.05,124.46 8.26,124.46 U$1.BU2
MQ2_H  (via drill 0.81)
  Top 0.406: v34.29,95.25 33.02,93.98 v33.02,92.71 | v15.88,93.98 14.61,92.71 8.26,92.71 U$1.BH1
  Bottom 0.406: E6.2 57.15,95.25 v34.29,95.25 | v33.02,92.71 29.85,92.71 28.58,93.98 v15.88,93.98
MQ3_H  (via drill 0.81)
  Top 0.406: v29.21,80.01 29.21,123.83 27.31,125.73 24.77,125.73 v24.77,120.65 | v21.59,120.02 20.96,119.38 20.96,113.67 19.05,111.76 v19.05,107.95
  Bottom 0.406: E5.2 55.88,76.2 38.74,76.2 36.83,78.11 36.83,80.01 v29.21,80.01 | v24.77,120.65 24.13,120.02 v21.59,120.02 | v19.05,107.95 15.24,107.95 14.61,108.58 8.26,108.58 U$1.BN2
MQ_ENABL  (via drill 0.81)
  Top 0.406: E5.3 57.15,80.01 57.15,83.82 | 57.15,83.82 57.15,94.61 55.88,95.89 E6.3 | v55.88,83.82 57.15,83.82 | v27.94,92.71 v27.94,83.82 | v17.15,92.71 14.61,90.17 8.26,90.17 U$1.BF1
  Bottom 0.406: v27.94,83.82 v55.88,83.82 | v17.15,92.71 v27.94,92.71
N$1  (via drill 0.81)
  Top 0.406: v66.68,93.34 78.74,81.28 v78.74,21.59 | v33.66,10.16 30.48,13.34 v30.48,29.21 | v15.88,30.48 14.61,29.21 8.26,29.21 U$1.AK1
  Bottom 0.406: E6.1 60.96,93.34 v66.68,93.34 | v78.74,21.59 67.31,10.16 v33.66,10.16 | v30.48,29.21 29.21,30.48 v15.88,30.48
N$2  (via drill 0.81)
  Top 0.406: E5.1 60.96,75.56 57.15,71.75 57.15,43.18 v54.61,40.64
  Bottom 0.406: v54.61,40.64 25.4,40.64 23.5,38.73 8.26,38.73 U$1.AN2
N$3  (via drill 0.81)
  Top 0.406: v60.96,26.04 E1.1 | v15.24,43.81 15.24,44.45 14.61,45.09 8.26,45.09 U$1.AR1
  Bottom 0.406: v60.96,26.04 57.15,29.84 57.15,41.91 24.13,41.91 22.23,43.81 v15.24,43.81
N$4  (via drill 0.81)
  Top 0.406: v17.78,48.26 17.78,56.52 17.15,57.15 15.24,57.15 15.24,55.88 14.61,55.24 8.26,55.24 U$1.AU1
  Bottom 0.406: E2.1 60.96,43.18 62.87,43.18 63.5,43.81 63.5,45.72 28.58,45.72 26.04,48.26 v17.78,48.26
NO_SHIFT  (via drill 0.81)
  Top 0.406: E1.7 46.99,21.59 46.99,34.29 48.26,35.56 E2.6 | v18.42,15.24 15.24,15.24 15.24,15.88 14.61,16.51 8.26,16.51 U$1.AE1
  Bottom 0.406: E1.7 45.72,15.24 v18.42,15.24
PC2_H  (via drill 0.81)
  Top 0.406: v46.99,85.09 v46.99,72.39 | v44.45,87.63 44.45,98.42 49.53,103.5 49.53,109.22 50.8,110.49 E7.5 | v16.51,46.99 16.51,42.55 8.26,42.55 U$1.AP1 | v21.59,46.99 24.77,50.16 24.77,56.52 24.13,57.15 v24.13,62.23 | E5.20 v50.8,63.5
  Bottom 0.406: E5.20 49.53,72.39 v46.99,72.39 | v44.45,87.63 v46.99,85.09 | v21.59,46.99 v16.51,46.99 | v24.13,62.23 25.4,63.5 v50.8,63.5
PC2_L  (via drill 0.81)
  Top 0.406: v48.26,62.23 E5.19 | v26.67,62.23 25.4,60.96 25.4,57.15 26.04,56.52 v26.04,46.35
  Bottom 0.406: v26.67,62.23 v48.26,62.23 | v26.04,46.35 25.4,45.72 8.26,45.72 U$1.AR2
PC3_H  (via drill 0.81)
  Top 0.406: v55.88,114.94 52.07,118.75 52.07,125.73 E8.5 | v19.69,57.15 19.69,53.98 20.32,53.34 20.32,47.62 19.05,46.35 19.05,39.37 8.26,39.37 U$1.AN1 | v39.37,59.69 44.45,64.77 v44.45,69.85
  Bottom 0.406: 59.69,72.39 63.5,76.2 71.12,76.2 72.39,77.47 72.39,114.94 v55.88,114.94 | 59.69,72.39 E5.23 | v19.69,57.15 20.96,58.42 31.12,58.42 32.39,59.69 v39.37,59.69 | v44.45,69.85 53.98,69.85 54.61,70.48 54.61,72.39 59.69,72.39
PC3_L  (via drill 0.81)
  Top 0.406: v34.29,49.53 v34.29,66.04 | v19.05,49.53 19.05,47.62 17.78,46.35 v17.78,42.55
  Bottom 0.406: E5.22 58.42,68.58 61.6,68.58 62.23,67.94 62.23,66.04 v34.29,66.04 | v19.05,49.53 v34.29,49.53 | v17.78,42.55 8.26,42.55 U$1.AP2
PC_ENABL  (via drill 0.81)
  Top 0.406: E7.6 46.99,113.03 46.99,121.92 | 46.99,121.92 46.99,125.73 E8.6 | v45.72,121.92 46.99,121.92
  Bottom 0.406: v45.72,121.92 27.94,121.92 24.77,118.75 8.26,118.75 U$1.BS2
SC2  (via drill 0.81)
  Top 0.406: v18.42,88.9 15.24,85.72 15.24,84.45 14.61,83.82 8.26,83.82 U$1.BD1
  Bottom 0.406: v18.42,88.9 E6.13
SC3  (via drill 0.81)
  Top 0.406: v26.67,109.86 v26.67,71.12 | v15.24,110.49 15.24,109.86 14.61,109.22 8.26,109.22 U$1.BN1
  Bottom 0.406: v26.67,71.12 E5.13 | v26.67,109.86 26.04,110.49 v15.24,110.49
SC_ENABL  (via drill 0.81)
  Top 0.406: E5.14 34.29,72.39 34.29,76.2 | 34.29,76.2 34.29,85.72 35.56,87 E6.14 | v33.02,76.2 34.29,76.2 | v20.32,76.2 19.05,77.47 v19.05,85.09
  Bottom 0.406: v20.32,76.2 v33.02,76.2 | v19.05,85.09 14.61,89.53 8.26,89.53 U$1.BF2
SHIFT_L1
  Top 0.406: E1.10 38.1,27.94 39.37,29.21 39.37,33.66 40.64,34.92 E2.9
  Bottom 0.406: E1.10 36.2,22.23 22.23,22.23 20.32,20.32 8.26,20.32 U$1.AF2
SHIFT_L2  (via drill 0.81)
  Top 0.406: E1.14 34.29,13.97 34.29,23.5 | 34.29,23.5 34.29,29.21 E2.14 | v33.02,23.5 34.29,23.5 | v16.51,23.5 8.26,23.5 U$1.AH1
  Bottom 0.406: v16.51,23.5 v33.02,23.5
SHIFT_R1  (via drill 0.81)
  Top 0.406: v41.91,35.56 44.45,33.02 44.45,22.23 43.18,20.95 E1.8
  Bottom 0.406: E2.10 40.64,35.56 v41.91,35.56 | E1.8 39.37,16.51 17.78,16.51 15.24,13.97 8.26,13.97 U$1.AD2
SHIFT_R2
  Top 0.406: E2.4 53.34,34.29 52.07,33.02 52.07,21.59 E1.4 49.53,16.51 49.53,12.06 39.37,1.91 18.42,1.91 18.42,9.53 14.61,13.34 8.26,13.34 U$1.AD1
SR2  (via drill 0.81)
  Top 0.406: v38.1,92.71 E6.10 | v18.42,91.44 15.24,88.27 15.24,87.63 14.61,87 8.26,87 U$1.BE1
  Bottom 0.406: v38.1,92.71 36.83,91.44 v18.42,91.44
SR3  (via drill 0.81)
  Top 0.406: E5.10 36.83,77.47 v36.83,69.85 | v21.59,72.39 17.78,76.2 v17.78,80.01
  Bottom 0.406: v36.83,69.85 24.13,69.85 v21.59,72.39 | v17.78,80.01 14.61,83.19 8.26,83.19 U$1.BD2
SR_ENABL  (via drill 0.81)
  Top 0.406: v16.51,77.47 15.24,78.74 15.24,79.38 14.61,80.01 8.26,80.01 U$1.BC1 | E6.11 35.56,90.81 34.29,89.53 34.29,87 33.02,85.72 v33.02,82.55 | E5.11 v35.56,82.55
  Bottom 0.406: E5.11 34.29,77.47 v16.51,77.47 | v35.56,82.55 v33.02,82.55
TT_SHIFT
  Top 0.406: E1.16 39.37,13.97 39.37,27.3 40.64,28.57 E2.16
  Bottom 0.406: E8.22 57.15,118.11 70.49,118.11 79.38,109.22 79.38,22.86 74.3,22.86 62.87,11.43 41.91,11.43 E1.16
VCC  (via drill 0.81)
  Top 0.813: C2P.+ 21.59,39.37 21.59,30.48 20.96,29.84 20.96,6.99 C1P.+ | C1.1 65.41,15.88 65.41,29.84 C2.1 | v50.8,54.61 C3.1 | C4P.+ 22.86,98.42 21.59,97.16 21.59,85.09 20.96,84.45 20.96,77.47 22.86,75.56 C3P.+ | R3.2 R2.2 R1.2 65.41,98.42 | C5.1 65.41,74.3 65.41,88.27 | C6.1 65.41,88.27 | C7.1 65.41,103.5 65.41,98.42 | 65.41,88.27 65.41,98.42 | v58.42,67.31 60.96,69.85 E5.24 | E1.24 v54.61,6.35
  Bottom 0.813: U$1.AA2 8.26,4.45 22.23,4.45 C1P.+ 24.13,6.35 v54.61,6.35 | E1.24 62.23,13.97 C1.1 63.5,17.14 73.66,27.3 E4.14 | E2.24 62.23,31.75 C2.1 | E3.14 49.53,52.07 C3.1 | E4.14 74.93,52.07 C4.1 76.2,55.24 78.11,57.15 78.11,72.39 C5.1 62.23,72.39 E5.24 | v50.8,54.61 69.85,54.61 E4.14 | U$1.BA2 8.26,73.66 15.88,73.66 17.15,72.39 19.05,72.39 C3P.+ 56.52,68.58 57.79,67.31 v58.42,67.31 | E8.24 62.23,120.65 C8.1 64.77,119.38 76.2,119.38 R2.2 | E7.24 62.23,105.41 C7.1 | E6.24 62.23,90.17 C6.1